# Altium schematic sheet 灯光驱动.SchDoc
size A4
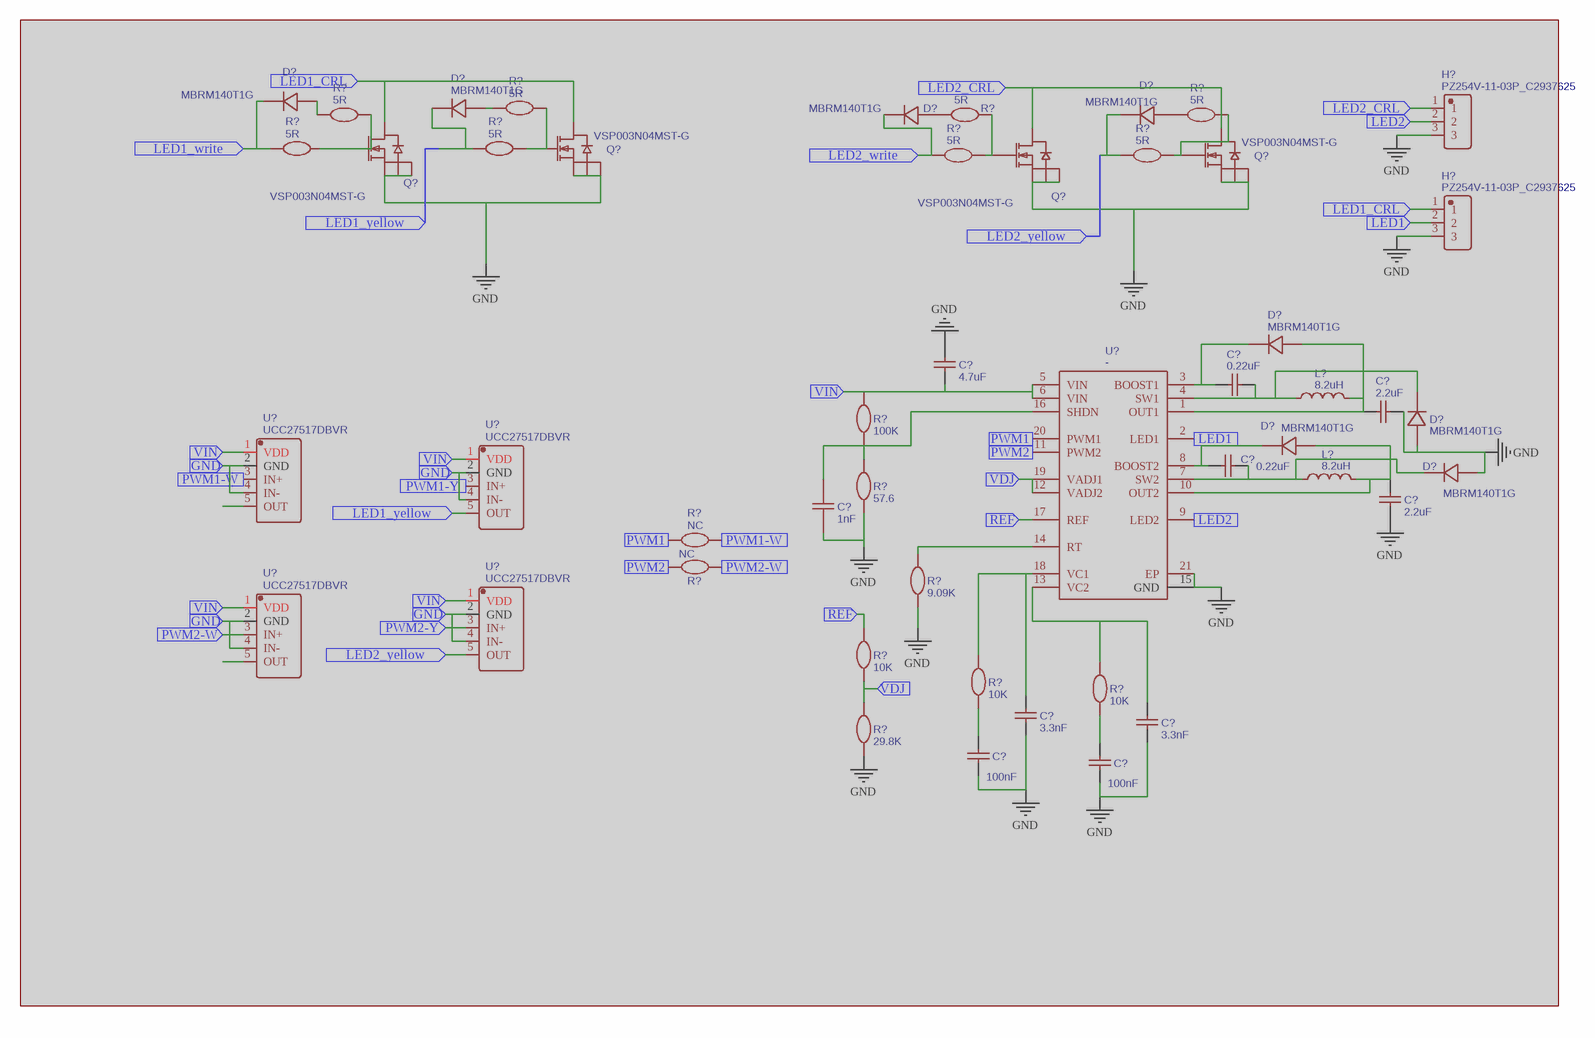
[diagram p0: 灯光驱动.SchDoc]

## Parts
(Parts that share a designator on the sheet are numbered #1, #2 ... from top to bottom, then left to right.)
C?#1  4.7uF  [C0603]  (masked out: inside a compile mask, not in the netlist)
C?#2  0.22uF  [C0603]  (masked out: inside a compile mask, not in the netlist)
C?#3  2.2uF  [C0603]  (masked out: inside a compile mask, not in the netlist)
C?#4  0.22uF  [C0603]  (masked out: inside a compile mask, not in the netlist)
C?#5  2.2uF  [C0603]  (masked out: inside a compile mask, not in the netlist)
C?#6  1nF  [C0603]  (masked out: inside a compile mask, not in the netlist)
C?#7  3.3nF  [C0603]  (masked out: inside a compile mask, not in the netlist)
C?#8  3.3nF  [C0603]  (masked out: inside a compile mask, not in the netlist)
C?#9  100nF  [C0603]  (masked out: inside a compile mask, not in the netlist)
C?#10  100nF  [C0603]  (masked out: inside a compile mask, not in the netlist)
D?#1  MBRM140T1G  [POWERMITE_L2.0-W1.9-LS3.8-RD]  (masked out: inside a compile mask, not in the netlist)
D?#2  MBRM140T1G  [POWERMITE_L2.0-W1.9-LS3.8-RD]  (masked out: inside a compile mask, not in the netlist)
D?#3  MBRM140T1G  [POWERMITE_L2.0-W1.9-LS3.8-RD]  (masked out: inside a compile mask, not in the netlist)
D?#4  MBRM140T1G  [POWERMITE_L2.0-W1.9-LS3.8-RD]  (masked out: inside a compile mask, not in the netlist)
D?#5  MBRM140T1G  [POWERMITE_L2.0-W1.9-LS3.8-RD]  (masked out: inside a compile mask, not in the netlist)
D?#6  MBRM140T1G  [POWERMITE_L2.0-W1.9-LS3.8-RD]  (masked out: inside a compile mask, not in the netlist)
D?#7  MBRM140T1G  [POWERMITE_L2.0-W1.9-LS3.8-RD]  (masked out: inside a compile mask, not in the netlist)
D?#8  MBRM140T1G  [POWERMITE_L2.0-W1.9-LS3.8-RD]  (masked out: inside a compile mask, not in the netlist)
H?#1  PZ254V-11-03P_C2937625  [HDR-TH_3P-P2.54-V-M]  (masked out: inside a compile mask, not in the netlist)
H?#2  PZ254V-11-03P_C2937625  [HDR-TH_3P-P2.54-V-M]  (masked out: inside a compile mask, not in the netlist)
L?#1  8.2uH  [IND-SMD_L7.0-W6.6_FXL0650]  (masked out: inside a compile mask, not in the netlist)
L?#2  8.2uH  [IND-SMD_L7.0-W6.6_FXL0650]  (masked out: inside a compile mask, not in the netlist)
Q?#1  VSP003N04MST-G  [DFN-8_L5.8-W4.9-P1.27-LS6.1-BL]  (masked out: inside a compile mask, not in the netlist)
Q?#2  VSP003N04MST-G  [DFN-8_L5.8-W4.9-P1.27-LS6.1-BL]  (masked out: inside a compile mask, not in the netlist)
Q?#3  VSP003N04MST-G  [DFN-8_L5.8-W4.9-P1.27-LS6.1-BL]  (masked out: inside a compile mask, not in the netlist)
Q?#4  VSP003N04MST-G  [DFN-8_L5.8-W4.9-P1.27-LS6.1-BL]  (masked out: inside a compile mask, not in the netlist)
R?#1  5R  [R0603]  (masked out: inside a compile mask, not in the netlist)
R?#2  5R  [R0603]  (masked out: inside a compile mask, not in the netlist)
R?#3  5R  [R0603]  (masked out: inside a compile mask, not in the netlist)
R?#4  5R  [R0603]  (masked out: inside a compile mask, not in the netlist)
R?#5  5R  [R0603]  (masked out: inside a compile mask, not in the netlist)
R?#6  5R  [R0603]  (masked out: inside a compile mask, not in the netlist)
R?#7  5R  [R0603]  (masked out: inside a compile mask, not in the netlist)
R?#8  5R  [R0603]  (masked out: inside a compile mask, not in the netlist)
R?#9  100K  [R0603]  (masked out: inside a compile mask, not in the netlist)
R?#10  57.6  [R0603]  (masked out: inside a compile mask, not in the netlist)
R?#11  NC  [R0603]  (masked out: inside a compile mask, not in the netlist)
R?#12  NC  [R0603]  (masked out: inside a compile mask, not in the netlist)
R?#13  9.09K  [R0603]  (masked out: inside a compile mask, not in the netlist)
R?#14  10K  [R0603]  (masked out: inside a compile mask, not in the netlist)
R?#15  10K  [R0603]  (masked out: inside a compile mask, not in the netlist)
R?#16  10K  [R0603]  (masked out: inside a compile mask, not in the netlist)
R?#17  29.8K  [R0603]  (masked out: inside a compile mask, not in the netlist)
U?#1  UCC27517DBVR  [SOT-23-5_L3.0-W1.7-P0.95-LS2.8-BR]  (masked out: inside a compile mask, not in the netlist)
U?#2  UCC27517DBVR  [SOT-23-5_L3.0-W1.7-P0.95-LS2.8-BR]  (masked out: inside a compile mask, not in the netlist)
U?#3  -  [HTSSOP-20_L6.5-W4.4-P0.65-LS6.4-BL-EP-3]  (masked out: inside a compile mask, not in the netlist)
U?#4  UCC27517DBVR  [SOT-23-5_L3.0-W1.7-P0.95-LS2.8-BR]  (masked out: inside a compile mask, not in the netlist)
U?#5  UCC27517DBVR  [SOT-23-5_L3.0-W1.7-P0.95-LS2.8-BR]  (masked out: inside a compile mask, not in the netlist)

## Ports
GND (in), LED1 (in), LED1_CRL (in), LED1_write (in), LED1_yellow (in), LED2 (in), LED2_CRL (in), LED2_write (in), LED2_yellow (in), PWM1 (in), PWM1-W (in), PWM1-Y (in), PWM2 (in), PWM2-W (in), PWM2-Y (in), REF (in), VDJ (in), VIN (in)

## Library data of the parts
C?#1 = 4.7uF: Manufacturer: muRata(村田); Manufacturer Part: GCM188R70J225KE22D; nameAlias: Value; Supplier: LCSC; Supplier Part: C126582; JLCPCB Part Class: Extended Part; spicePre: C; spiceSymbolName: GCM188R70J225KE22D
C?#2 C?#4 = 0.22uF: Manufacturer: muRata(村田); Manufacturer Part: GCM188R70J225KE22D; nameAlias: Value; Supplier: LCSC; Supplier Part: C126582; JLCPCB Part Class: Extended Part; spicePre: C; spiceSymbolName: GCM188R70J225KE22D
C?#3 C?#5 = 2.2uF: Manufacturer: muRata(村田); Manufacturer Part: GCM188R70J225KE22D; nameAlias: Value; Supplier: LCSC; Supplier Part: C126582; JLCPCB Part Class: Extended Part; spicePre: C; spiceSymbolName: GCM188R70J225KE22D
C?#6 = 1nF: nameAlias: Value(F); Contributor: LCEDA_Lib; spicePre: C; spiceSymbolName: C_0603_US
C?#7 C?#8 = 3.3nF: Manufacturer: muRata(村田); Manufacturer Part: GCM188R70J225KE22D; nameAlias: Value; Supplier: LCSC; Supplier Part: C126582; JLCPCB Part Class: Extended Part; spicePre: C; spiceSymbolName: GCM188R70J225KE22D
C?#9 C?#10 = 100nF: Manufacturer: muRata(村田); Manufacturer Part: GCM188R70J225KE22D; nameAlias: Value; Supplier: LCSC; Supplier Part: C126582; JLCPCB Part Class: Extended Part; spicePre: C; spiceSymbolName: GCM188R70J225KE22D
D?#1-D?#8 = MBRM140T1G: Manufacturer: onsemi(安森美); Contributor: LCSC; Supplier: LCSC; Manufacturer Part: MBRM140T1G; Supplier Part: C132634; JLCPCB Part Class: Extended Part; spicePre: D; spiceSymbolName: MBRM140T1G
H?#1 H?#2 = PZ254V-11-03P_C2937625: Manufacturer: XFCN(兴飞); Contributor: LCSC; Supplier: LCSC; Supplier Part: C2937625; Manufacturer Part: PZ254V-11-03P; JLCPCB Part Class: Extended Part; spicePre: H; spiceSymbolName: PZ254V-11-03P_C2937625
L?#1 L?#2 = 8.2uH: Manufacturer: cjiang(长江微电); Manufacturer Part: FXL0650-8R2-M; nameAlias: Value; Contributor: LCSC; Supplier: LCSC; Supplier Part: C475529; JLCPCB Part Class: Extended Part; spicePre: L; spiceSymbolName: FXL0650-8R2-M
Q?#1-Q?#4 = VSP003N04MST-G: Manufacturer: Vergiga(威兆); Contributor: lcsc; Supplier: LCSC; Supplier Part: C3036325; Manufacturer Part: VSP003N04MST-G; JLCPCB Part Class: Extended Part; spicePre: Q; spiceSymbolName: VSP003N04MST-G
R?#1-R?#8 = 5R: nameAlias: Value(Ω); Contributor: LCEDA_Lib; spicePre: R; spiceSymbolName: R_0603_EU
R?#9 = 100K: nameAlias: Value(Ω); Contributor: LCEDA_Lib; spicePre: R; spiceSymbolName: R_0603_EU
R?#10 = 57.6: nameAlias: Value(Ω); Contributor: LCEDA_Lib; spicePre: R; spiceSymbolName: R_0603_EU
R?#11 R?#12 = NC: nameAlias: Value(Ω); Contributor: LCEDA_Lib; spicePre: R; spiceSymbolName: R_0603_EU
R?#13 = 9.09K: nameAlias: Value(Ω); Contributor: LCEDA_Lib; spicePre: R; spiceSymbolName: R_0603_EU
R?#14-R?#16 = 10K: nameAlias: Value(Ω); Contributor: LCEDA_Lib; spicePre: R; spiceSymbolName: R_0603_EU
R?#17 = 29.8K: nameAlias: Value(Ω); Contributor: LCEDA_Lib; spicePre: R; spiceSymbolName: R_0603_EU
U?#1 U?#2 U?#4 U?#5 = UCC27517DBVR: Manufacturer: TI(德州仪器); Supplier: LCSC; Manufacturer Part: UCC27517DBVR; Supplier Part: C99395; JLCPCB Part Class: Extended Part; spicePre: U; spiceSymbolName: UCC27517DBVR
U?#3 = -: Manufacturer: ADI(亚德诺); Manufacturer Part: LT3475EFE#PBF; nameAlias: Value; Supplier: LCSC; Supplier Part: C107841; JLCPCB Part Class: Extended Part; spicePre: U; spiceSymbolName: LT3475EFE#PBF